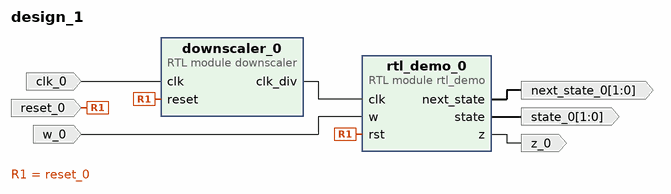
[diagram p0: block diagram of the top level]
# Vivado block design design_1, xc7z020clg400-1, Vivado 2023.1
create_bd_design design_1

create_bd_port -dir I w_0
create_bd_port -dir O z_0
create_bd_port -dir O -from 1 -to 0 state_0
create_bd_port -dir O -from 1 -to 0 next_state_0
create_bd_port -dir I -type clk clk_0
create_bd_port -dir I -type rst reset_0

create_bd_cell -type module -reference rtl_demo rtl_demo_0
create_bd_cell -type module -reference downscaler downscaler_0

# ---- connections ----

connect_bd_net -net clk_0_1 [get_bd_ports clk_0] [get_bd_pins downscaler_0/clk]
connect_bd_net [get_bd_pins downscaler_0/clk_div] [get_bd_pins rtl_demo_0/clk]
connect_bd_net -net reset_0_1 [get_bd_ports reset_0] [get_bd_pins downscaler_0/reset] [get_bd_pins rtl_demo_0/rst]
connect_bd_net [get_bd_pins rtl_demo_0/next_state] [get_bd_ports next_state_0]
connect_bd_net [get_bd_pins rtl_demo_0/state] [get_bd_ports state_0]
connect_bd_net [get_bd_pins rtl_demo_0/z] [get_bd_ports z_0]
connect_bd_net -net w_0_1 [get_bd_ports w_0] [get_bd_pins rtl_demo_0/w]

validate_bd_design
save_bd_design
